# EAGLE design L293_large (EAGLE 6.1)
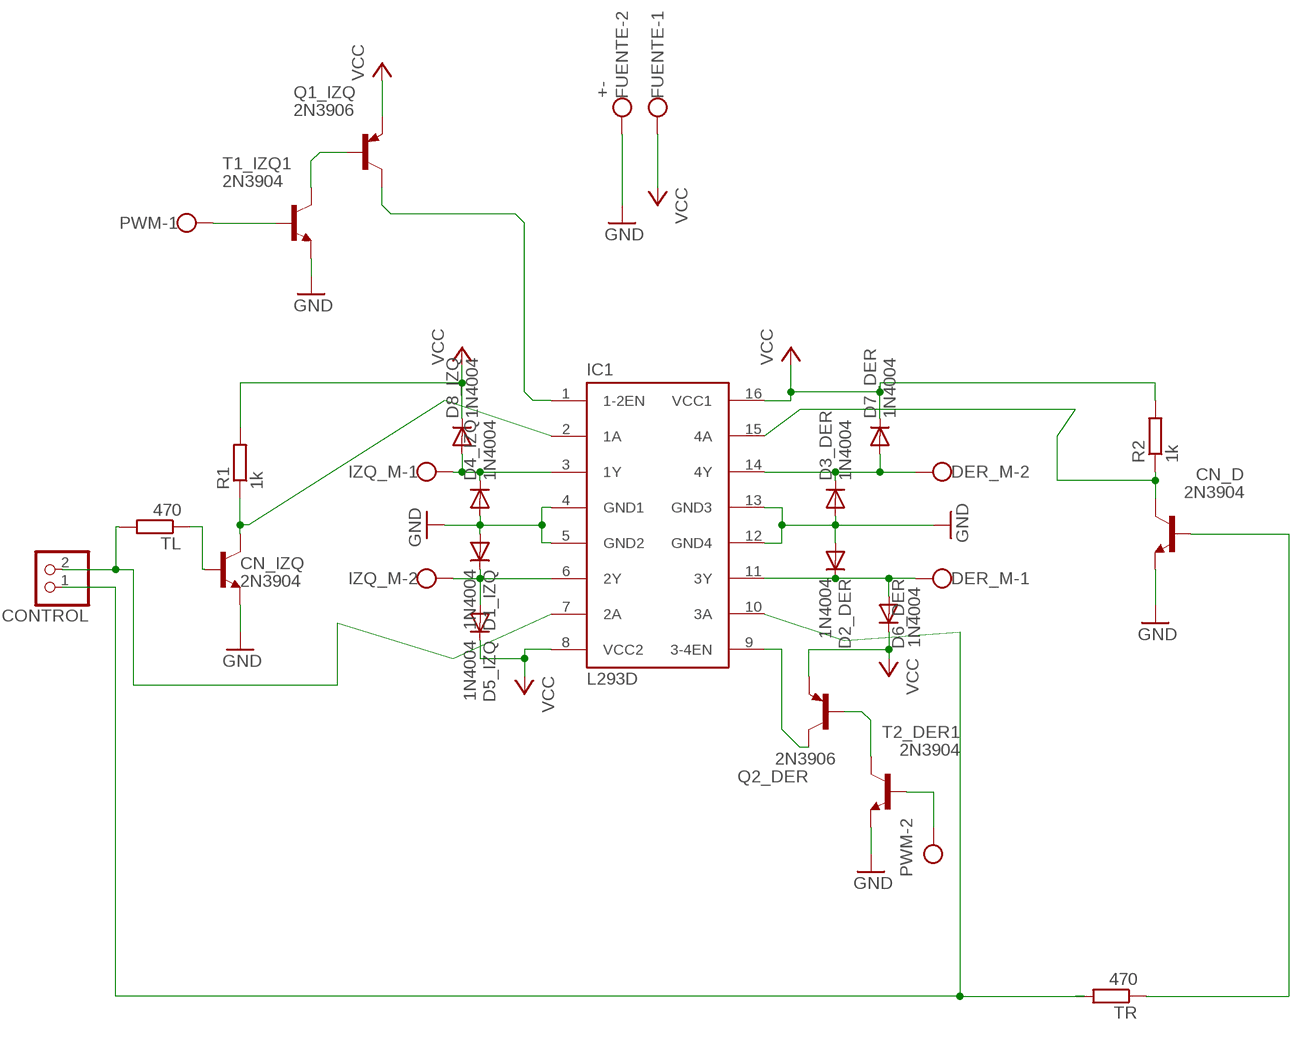
[diagram p0: schematic, sheet 1]

## Parts
CN_D  2N3904  [TO92]
CN_IZQ  2N3904  [TO92]
CONTROL  PINHD-1X2/90  [1X02/90]
D1_IZQ  1N4004  [DO41-10]
D2_DER  1N4004  [DO41-10]
D3_DER  1N4004  [DO41-10]
D4_IZQ  1N4004  [DO41-10]
D5_IZQ  1N4004  [DO41-10]
D6_DER  1N4004  [DO41-10]
D7_DER  1N4004  [DO41-10]
D8_IZQ  1N4004  [DO41-10]
DER_M  W237-02P  [W237-132]
FUENTE  +-  W237-02P  [W237-132]
IC1  L293D  [DIL16]
IZQ_M  W237-02P  [W237-132]
PWM  W237-02P  [W237-132]
Q1_IZQ  2N3906  [TO92]
Q2_DER  2N3906  [TO92]
R1  1k  R-EU_0207/5V  [0207/5V]
R2  1k  R-EU_0207/5V  [0207/5V]
T1_IZQ1  2N3904  [TO92]
T2_DER1  2N3904  [TO92]
TL  470  R-EU_0207/5V  [0207/5V]
TR  470  R-EU_0207/5V  [0207/5V]

## Nets
GND: CN_D.3(E) CN_IZQ.3(E) D1_IZQ.A D2_DER.A D3_DER.A D4_IZQ.A FUENTE.2 IC1.4(GND1) IC1.5(GND2) IC1.12(GND4) IC1.13(GND3) T1_IZQ1.3(E) T2_DER1.3(E)
N$1: D2_DER.C D6_DER.A DER_M.1 IC1.11(3Y)
N$2: D3_DER.C D7_DER.A DER_M.2 IC1.14(4Y)
N$3: D1_IZQ.C D5_IZQ.A IC1.6(2Y) IZQ_M.2
N$4: D4_IZQ.C D8_IZQ.A IC1.3(1Y) IZQ_M.1
N$5: CONTROL.2 IC1.7(2A) TL.2
N$6: CN_IZQ.2(B) TL.1
N$7: CN_IZQ.1(C) IC1.2(1A) R1.1
N$8: CN_D.2(B) TR.1
N$9: CN_D.1(C) IC1.15(4A) R2.1
N$10: Q1_IZQ.2(B) T1_IZQ1.1(C)
N$11: IC1.1(1-2EN) Q1_IZQ.1(C)
N$12: CONTROL.1 IC1.10(3A) TR.2
N$13: PWM.1 T1_IZQ1.2(B)
N$14: Q2_DER.2(B) T2_DER1.1(C)
N$15: PWM.2 T2_DER1.2(B)
N$17: IC1.9(3-4EN) Q2_DER.1(C)
VCC: D5_IZQ.C D6_DER.C D7_DER.C D8_IZQ.C FUENTE.1 IC1.8(VCC2) IC1.16(VCC1) Q1_IZQ.3(E) Q2_DER.3(E) R1.2 R2.2

## Library data of the parts
CN_D CN_IZQ T1_IZQ1 T2_DER1 = transistor:2N3904: NPN TRANSISTOR
CONTROL = pinhead:PINHD-1X2: PIN HEADER
D1_IZQ D2_DER D3_DER D4_IZQ D5_IZQ D6_DER D7_DER D8_IZQ = diode:1N4004: DIODE general purpose rectifier, 1 A
DER_M FUENTE IZQ_M PWM = con-wago-508:W237-02P: WAGO SREW CLAMP
IC1 = st-microelectronics:L293D: PUSH-PULL 4 CHANNEL DRIVER
Q1_IZQ Q2_DER = transistor-pnp:2N3906: PNP Transistor
R1 R2 TL TR = rcl:R-EU_: RESISTOR, European symbol

## Board
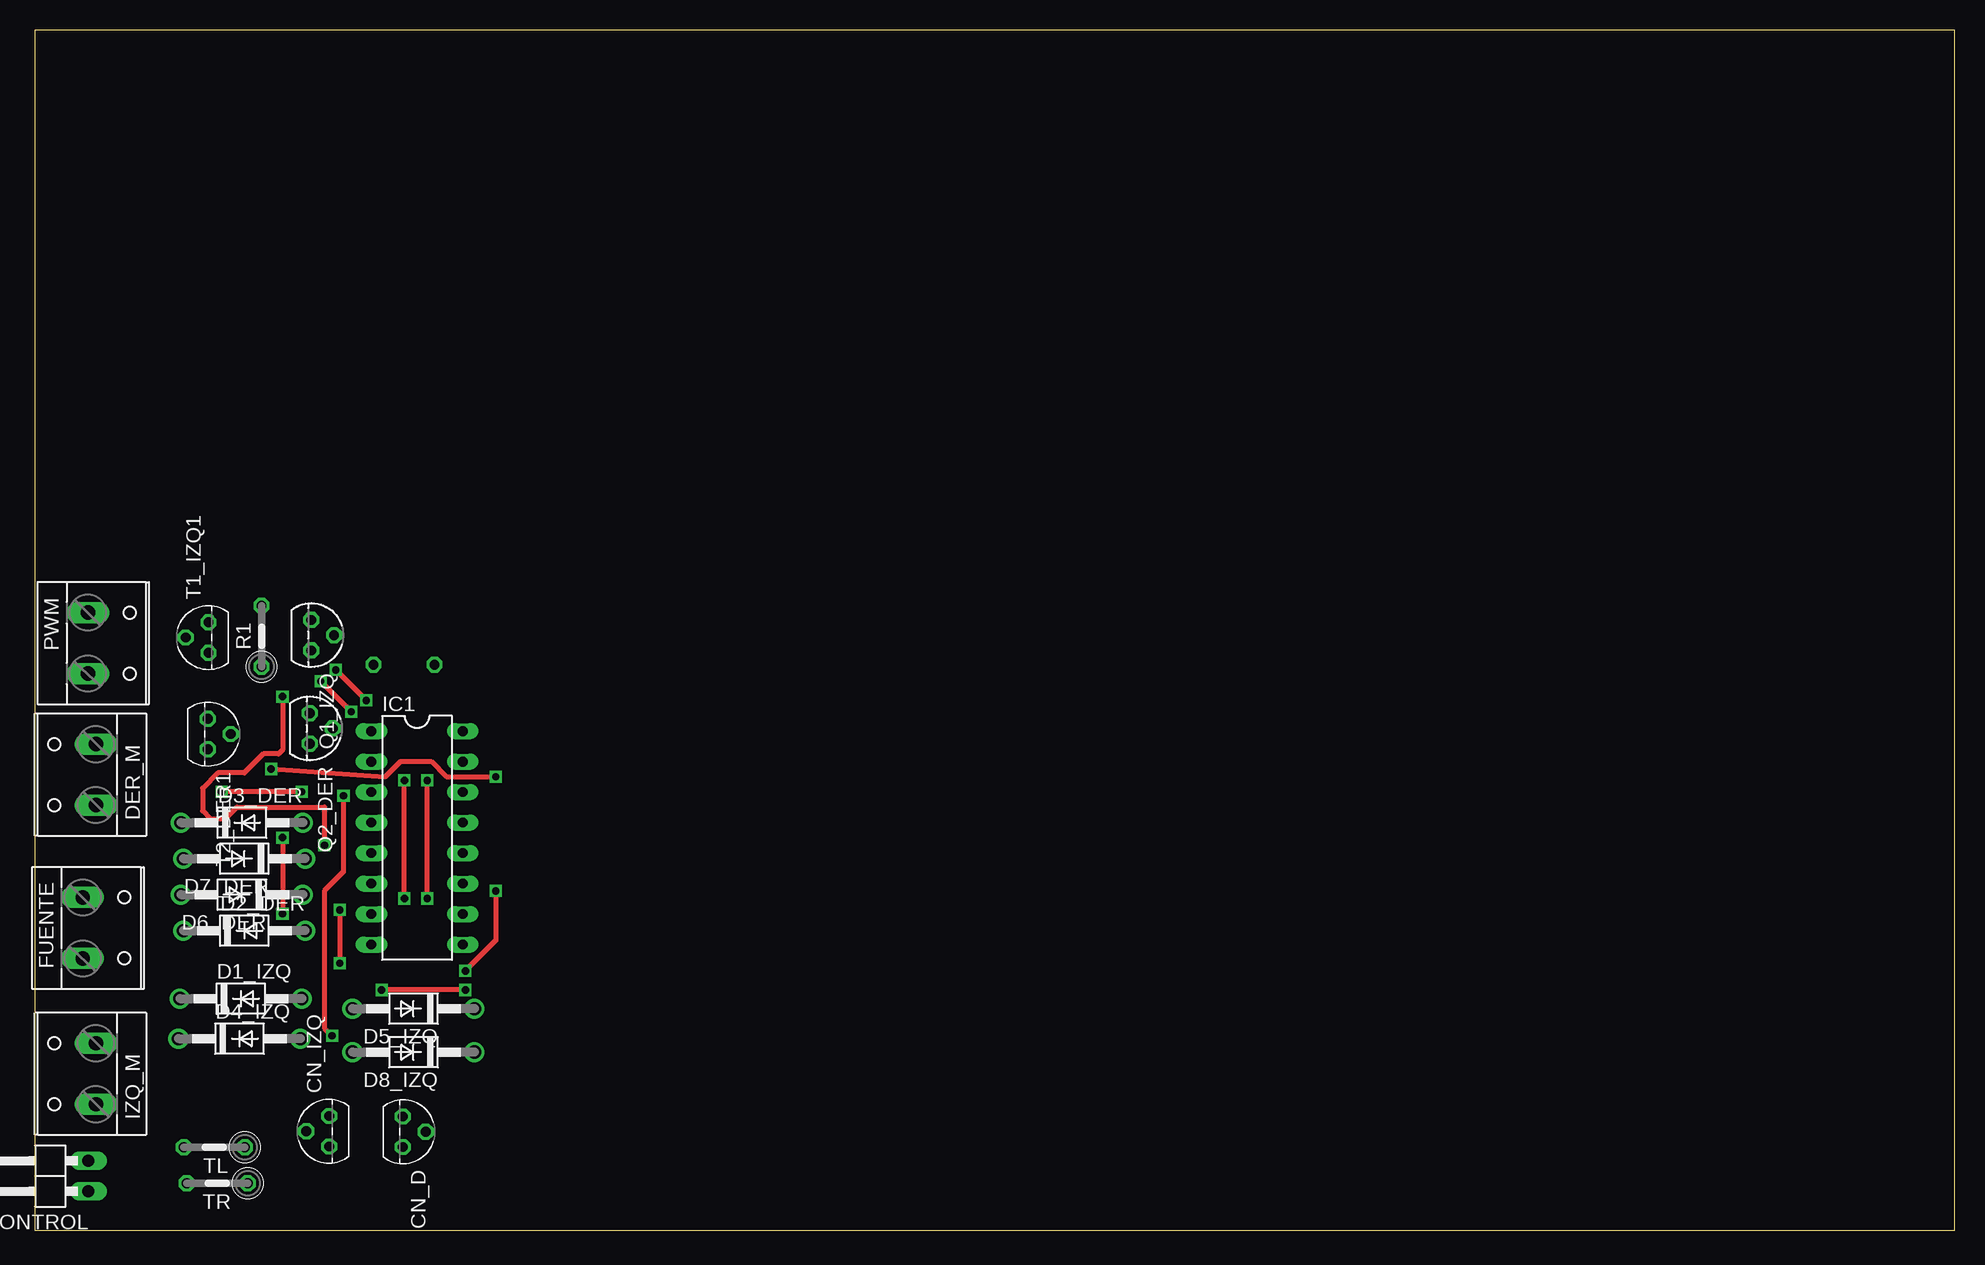
[diagram p1: board, top side]
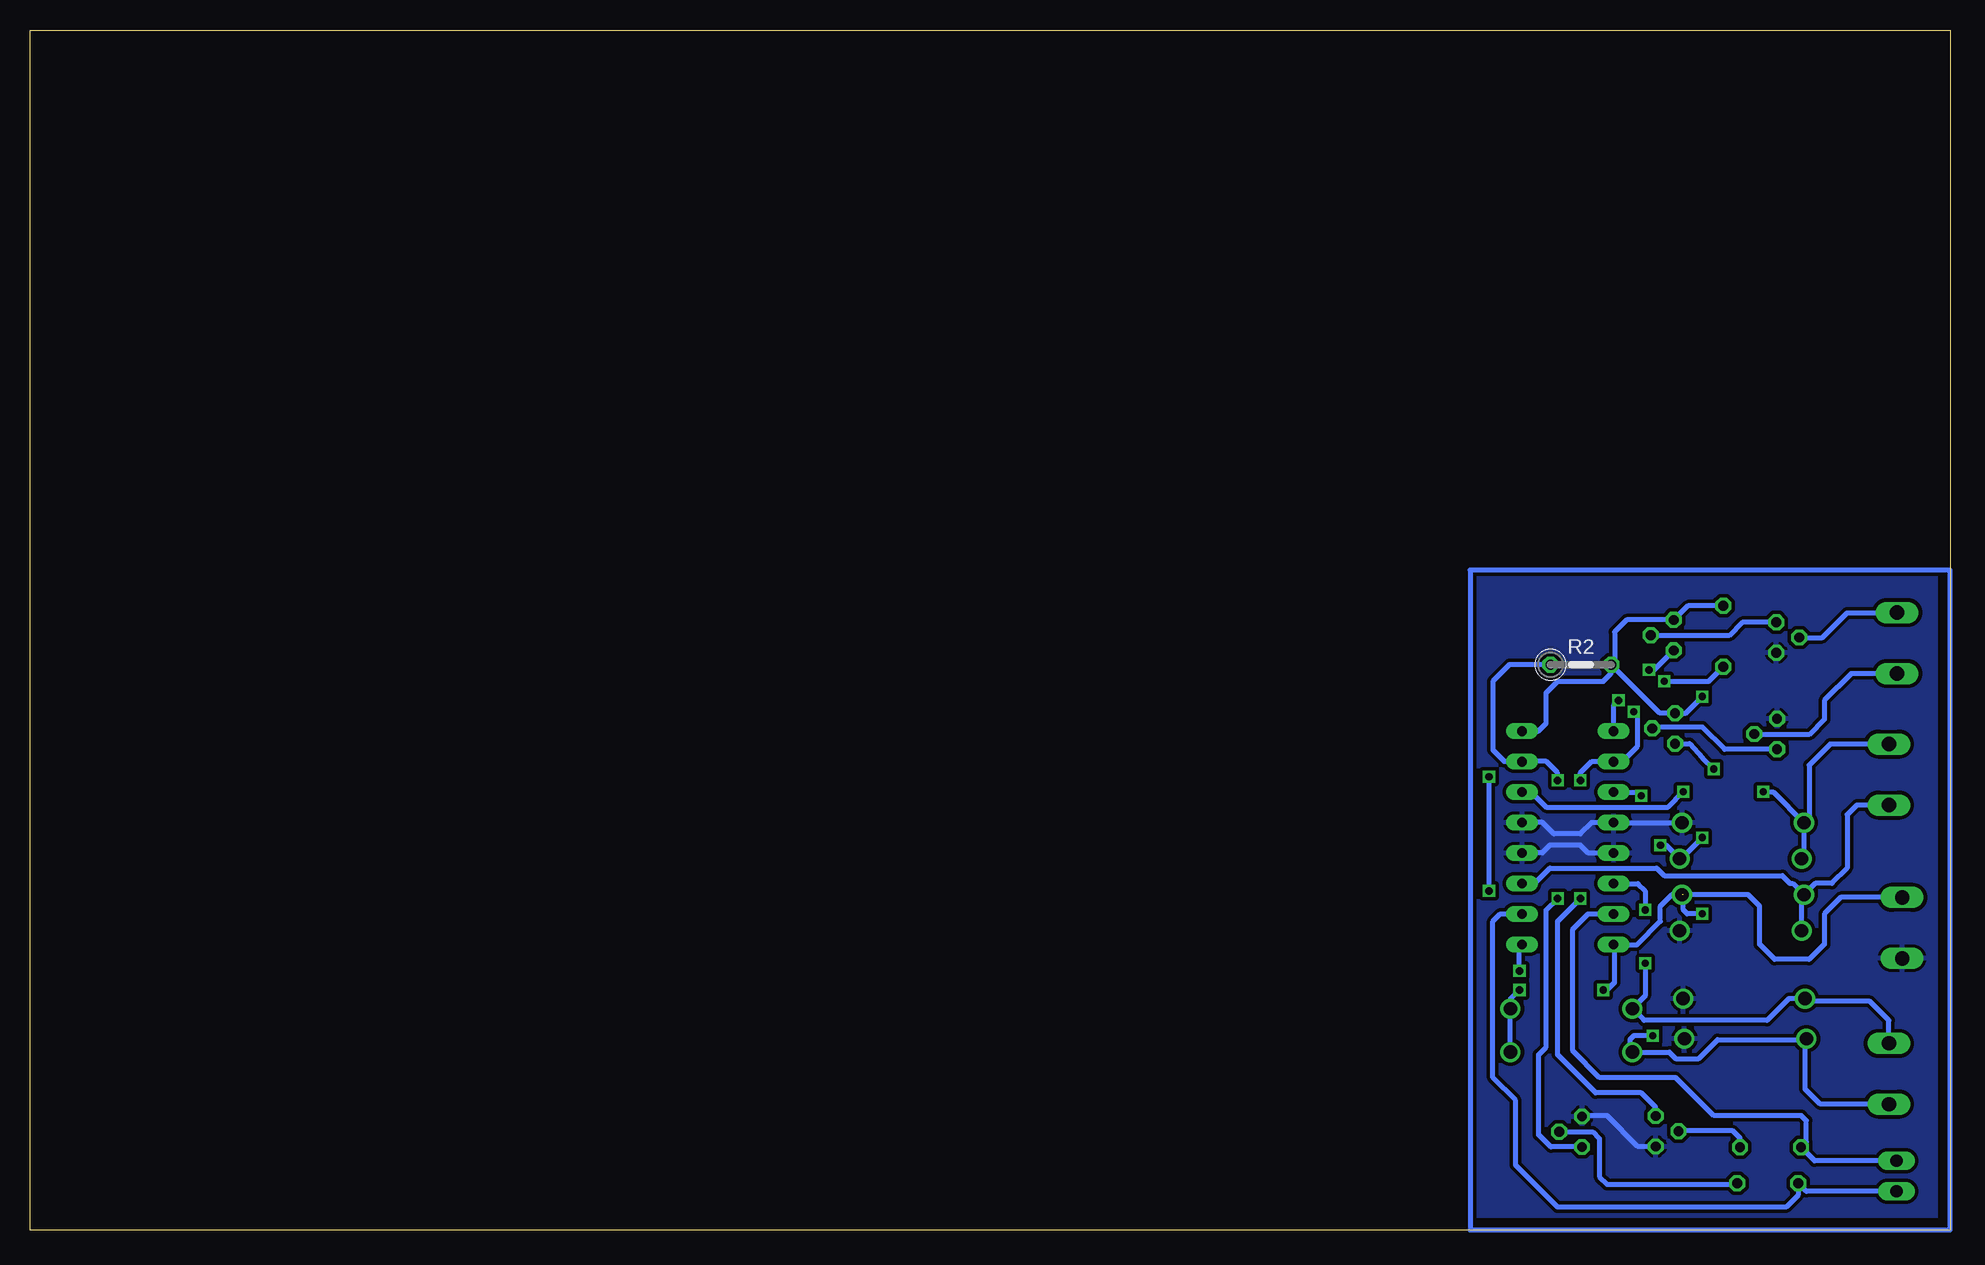
[diagram p2: board, bottom side, seen from below]

Size 160 x 100 mm. Coordinates in mm from the lower left corner, seen from the top.
Outline: 0,0 160,0 160,100 0,100 0,0
Copper layers (1*16): Top 0.035mm / dielectric 1.5mm / Bottom 0.035mm
Design rules: minimum track width 10mil, minimum drill 24mil, track to track 12mil, track to pad 12mil, pad to pad 12mil, via to via 12mil, smd to smd 12mil, copper to edge 40mil, drill to drill 8mil, minimum pad ring 10mil, minimum via ring 8mil, stop-mask expansion 4mil, vias tented up to drill 0mil, thermal gap 10mil

### Footprints (pad centres in the part's own frame; a part is rotated, then mirrored left to right if it is on the bottom)
TO92 = drill 0.813 octagon: 1 1.27,0; 2 0,1.905; 3 -1.27,0
1X02/90 = drill 1.016 long: 1 -1.27,-3.81; 2 1.27,-3.81
DO41-10 = drill 1.118: A 5.08,0; C -5.08,0
W237-132 = drill 1.194 long: 1 -2.54,-0.635; 2 2.54,-0.635
DIL16 = drill 0.813 long: 1 -8.89,-3.81; 2 -6.35,-3.81; 3 -3.81,-3.81; 4 -1.27,-3.81; 5 1.27,-3.81; 6 3.81,-3.81; 7 6.35,-3.81; 8 8.89,-3.81; 9 8.89,3.81; 10 6.35,3.81; 11 3.81,3.81; 12 1.27,3.81; 13 -1.27,3.81; 14 -3.81,3.81; 15 -6.35,3.81; 16 -8.89,3.81
0207/5V = drill 0.813 octagon: 1 -2.54,0; 2 2.54,0

### Placement (x,y rotation side)
CN_D  30.66,8.19 270 top
CN_IZQ  24.52,8.23 90 top
CONTROL  0.65,4.49 90 top
D1_IZQ  17.16,19.28 0 top
D2_DER  17.45,24.94 0 top
D3_DER  17.25,33.94 0 top
D4_IZQ  17.05,15.94 0 top
D5_IZQ  31.55,18.44 180 top
D6_DER  17.25,27.94 180 top
D7_DER  17.45,30.94 180 top
D8_IZQ  31.55,14.82 180 top
DER_M  4.45,37.95 90 top
FUENTE  4.62,25.17 270 top
IC1  31.85,32.68 270 top
IZQ_M  4.45,13.02 90 top
PWM  5.05,48.91 270 top
Q1_IZQ  23.03,49.57 270 top
Q2_DER  22.91,41.8 270 top
R1  18.89,49.48 90 top
R2  30.76,47.11 0 bottom
T1_IZQ1  14.47,49.37 90 top
T2_DER1  14.41,41.33 270 top
TL  14.96,6.9 180 top
TR  15.2,3.9 180 top

### Tracks (layer width: path | path; a pad name or v marks a point on that pad's centre or on a via)
GND
  Bottom 0.406: IC1.13 35.64,33.97 33.97,33.97 33.02,33.02 30.8,33.02 29.87,33.95 IC1.4 D3_DER.A | IC1.5 30.14,31.41 30.8,32.07 33.34,32.07 33.97,31.43 35.64,31.43 IC1.12 | CN_IZQ.3 26.01,6.96 28.57,9.53 30.6,9.53 CN_D.3
  pour Bottom: 0,0 0,55.24 39.69,55.24 40.01,54.93 40.01,0.32 39.69,0
N$1
  Bottom 0.406: IC1.11 34.63,28.87 33.34,30.16 24.45,30.16 23.81,29.53 13.97,29.53 13.34,28.89 13.12,28.89 D6_DER.A | DER_M.1 7.77,35.41 8.57,34.61 8.57,30.16 9.84,28.89 11.22,28.89 D6_DER.A | D2_DER.C 12.37,27.74 D6_DER.A
N$2  (via drill 0.6)
  Top 0.406: v22.23,36.51 v15.56,36.51
  Bottom 0.406: IC1.14 34.9,36.49 33.66,35.24 23.5,35.24 v22.23,36.51 | v15.56,36.51 14.74,36.51 D3_DER.C | D3_DER.C 12.17,31.14 D7_DER.A | DER_M.2 9.99,40.49 11.75,38.73 11.75,34.36 D3_DER.C
N$3  (via drill 0.6)
  Top 0.406: v25.4,26.67 v25.4,22.23
  Bottom 0.406: IZQ_M.2 5.08,17.47 6.67,19.05 11.85,19.05 D1_IZQ.C 13.42,19.28 15.24,17.46 25.49,17.46 D5_IZQ.A 25.4,19.51 v25.4,22.23 | IC1.6 26.01,28.87 25.4,28.26 v25.4,26.67
N$4  (via drill 0.6)
  Top 0.406: v25.72,36.2 25.72,29.84 24.13,28.26 24.13,16.83 v24.77,16.19
  Bottom 0.406: IZQ_M.1 10.8,10.48 12.06,11.75 12.06,15.85 D4_IZQ.C 12.04,15.88 19.37,15.88 20.95,14.29 22.86,14.29 23.39,14.82 D8_IZQ.A 26.67,15.02 26.67,15.88 26.35,16.19 v24.77,16.19 | IC1.3 26.01,36.49 v25.72,36.2
N$5
  Bottom 0.406: CONTROL.2 11.28,5.76 TL.2 11.96,7.35 11.96,9.11 12.38,9.53 19.68,9.53 22.86,12.7 29.21,12.7 31.43,14.92 31.43,25.08 30.16,26.35 28.06,26.35 IC1.7
N$6
  Bottom 0.406: TL.1 17.5,7.65 18.1,8.26 22.59,8.26 CN_IZQ.2
N$7  (via drill 0.6)
  Top 0.406: v30.8,27.62 v30.8,37.47 | v26.35,43.18 v23.81,45.72
  Bottom 0.406: CN_IZQ.1 24.52,10.24 25.72,11.43 29.53,11.43 32.7,14.61 32.7,25.72 v30.8,27.62 | v30.8,37.47 30.8,38.1 29.84,39.05 28.06,39.05 IC1.2 27.33,39.03 26.04,40.32 26.04,42.86 v26.35,43.18 | v23.81,45.72 20.11,45.72 R1.1
N$8
  Bottom 0.406: CN_D.2 29.78,8.19 29.21,7.62 29.21,4.45 28.57,3.81 17.82,3.81 TR.1
N$9  (via drill 0.6)
  Top 0.406: v32.7,27.62 v32.7,37.47
  Bottom 0.406: R2.1 36.71,47.11 38.1,45.72 38.1,40.01 37.15,39.05 35.68,39.05 IC1.15 35.64,39.05 33.66,39.05 32.7,38.1 v32.7,37.47 | CN_D.1 33.27,6.92 34.29,7.94 34.29,14.61 33.66,15.24 33.66,26.67 v32.7,27.62
N$10
  Bottom 0.406: T1_IZQ1.1 17.3,50.64 18.41,49.53 24.89,49.53 Q1_IZQ.2
N$11  (via drill 0.6)
  Top 0.406: v27.62,44.13 v25.08,46.67
  Bottom 0.406: IC1.1 28.04,43.72 v27.62,44.13 | v25.08,46.67 24.66,46.67 Q1_IZQ.1
N$12
  Bottom 0.406: CONTROL.1 11.98,3.22 TR.2 12.65,2.9 13.65,1.91 32.7,1.91 36.2,5.4 36.2,10.79 38.1,12.7 38.1,25.72 37.47,26.35 35.68,26.35 IC1.10
N$13
  Bottom 0.406: T1_IZQ1.2 10.64,49.37 8.57,51.44 4.43,51.44 PWM.1
N$14
  Bottom 0.406: T2_DER1.1 18.79,40.06 20.64,41.91 24.7,41.91 Q2_DER.2
N$15
  Bottom 0.406: PWM.2 8.24,46.37 10.48,44.13 10.48,42.55 11.75,41.27 16.26,41.27 T2_DER1.2
N$16
  Bottom 0.406: 40,0 40,55 0,55 0,0 40.01,0
N$17  (via drill 0.6)
  Top 0.406: v19.68,38.42 29.21,37.78 30.48,39.05 33.02,39.05 34.29,37.78 v38.42,37.78 | v38.42,28.26 38.42,24.13 v35.88,21.59
  Bottom 0.406: Q2_DER.1 21.7,40.53 20.64,39.37 v19.68,38.42 | v38.42,37.78 v38.42,28.26 | v35.88,21.59 35.88,23.57 IC1.9
VCC  (via drill 0.6)  (1 unrouted)
  Top 0.406: v35.88,20 v28.89,20 | v20.64,44.45 20.64,40.01 20.32,39.69 19.05,39.69 17.46,38.1 15.24,38.1 13.97,36.83 13.97,34.92 14.61,34.29 15.88,34.29 16.83,35.24 24.13,35.24 v24.13,32.07 | v20.64,32.7 v20.64,26.35
  Bottom 0.406: R1.2 21.85,52.02 Q1_IZQ.3 26.95,50.84 27.94,49.85 27.94,47.39 R2.2 | IC1.16 34.31,41.57 33.66,42.23 33.66,44.77 32.7,45.72 28.89,45.72 28.26,46.35 28.26,47.07 R2.2 | D8_IZQ.C D5_IZQ.C 36.63,19.25 v35.88,20 | R2.2 24.18,43.07 Q2_DER.3 22.02,43.07 v20.64,44.45 | v28.89,20 28.57,20 27.94,20.64 27.94,23.69 IC1.8 26.06,23.79 24.13,25.72 24.13,26.99 23.18,27.94 D6_DER.C | FUENTE.1 9.12,27.71 10.48,26.35 10.48,23.81 11.75,22.54 14.61,22.54 15.88,23.81 15.88,26.99 16.83,27.94 22.23,27.94 22.23,26.67 21.91,26.35 v20.64,26.35 | v24.13,32.07 23.66,32.07 D7_DER.C 22.4,30.94 v20.64,32.7